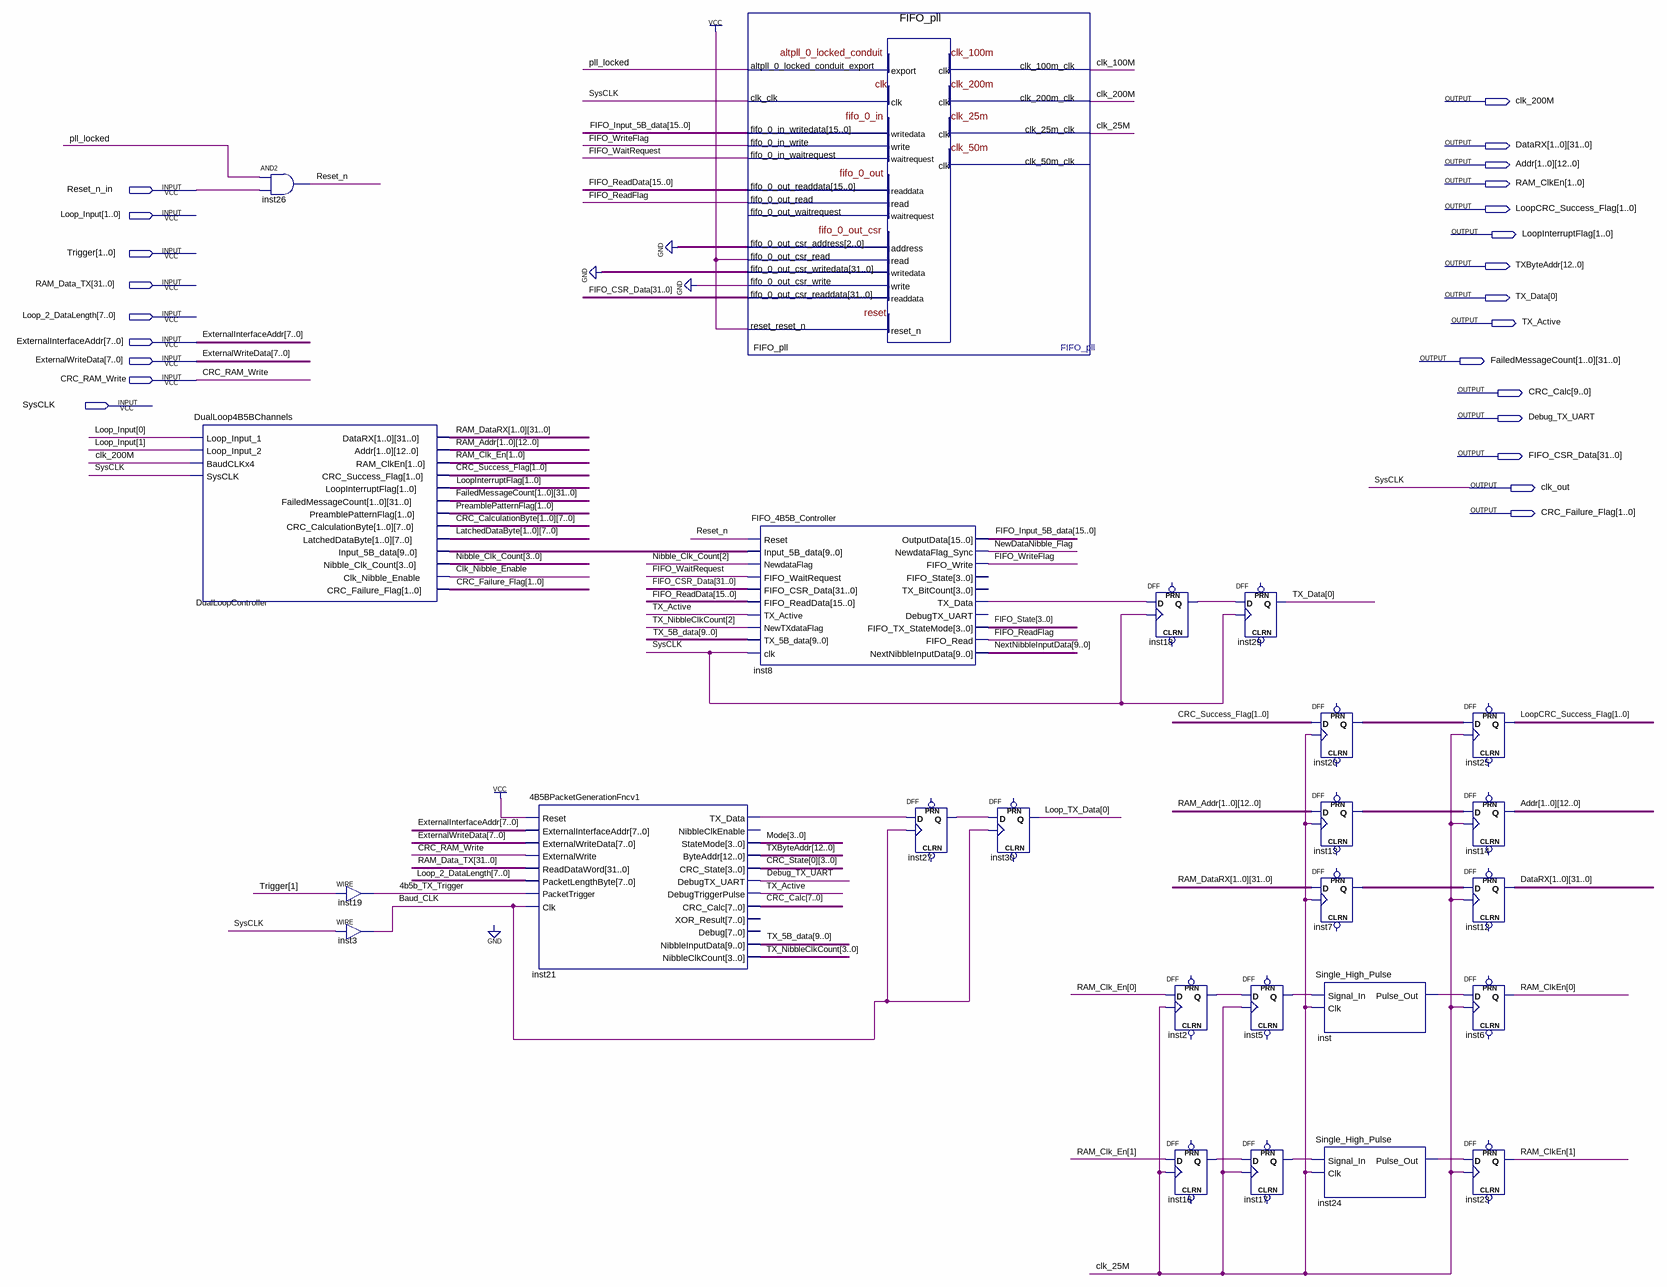
[diagram p0: schematic sheet]
// Quartus schematic LoopDataController.bdf as structural Verilog: 25 symbols, 24 pins
module LoopDataController (
  input  Reset_n_in,
  input  [1:0] Loop_Input,
  input  [1:0] Trigger,
  input  [31:0] RAM_Data_TX,
  input  [7:0] Loop_2_DataLength,
  input  [7:0] ExternalInterfaceAddr,
  input  [7:0] ExternalWriteData,
  input  CRC_RAM_Write,
  input  SysCLK,
  output clk_200M,
  output [31:0] DataRX_1,
  output [31:0] DataRX_0,
  output [12:0] Addr_1,
  output [12:0] Addr_0,
  output [1:0] RAM_ClkEn,
  output [1:0] LoopCRC_Success_Flag,
  output [1:0] LoopInterruptFlag,
  output [12:0] TXByteAddr,
  output [0:0] TX_Data,
  output TX_Active,
  output [31:0] FailedMessageCount_1,
  output [31:0] FailedMessageCount_0,
  output [9:0] CRC_Calc,
  output Debug_TX_UART,
  output [31:0] FIFO_CSR_Data,
  output clk_out,
  output [1:0] CRC_Failure_Flag
);

  wire \4b5b_TX_Trigger , Baud_CLK, clk_25M, clk_100M, Clk_Nibble_Enable, FIFO_ReadFlag, FIFO_WaitRequest,
       FIFO_WriteFlag, inst2_q, inst5_q, inst8_tx_data, inst16_q, inst17_q, inst18_q, inst21_tx_data,
       inst24_pulse_out, inst27_q, inst_pulse_out, NewDataNibble_Flag, pll_locked, Reset_n;
  wire [0:0] Loop_TX_Data;
  wire [1:0] CRC_Success_Flag, inst20_q, PreamblePatternFlag, RAM_Clk_En;
  wire [3:0] CRC_State_0, FIFO_State, Mode, Nibble_Clk_Count, TX_NibbleClkCount;
  wire [7:0] CRC_CalculationByte_0, CRC_CalculationByte_1, LatchedDataByte_0, LatchedDataByte_1;
  wire [9:0] DualLoopController_input_5b_data, NextNibbleInputData, TX_5B_data;
  wire [12:0] RAM_Addr_0, RAM_Addr_1;
  wire [15:0] FIFO_Input_5B_data, FIFO_ReadData;
  wire [25:0] inst13_q;
  wire [31:0] RAM_DataRX_0, RAM_DataRX_1;
  wire [63:0] inst7_q;

  DualLoop4B5BChannels DualLoopController (
    .Loop_Input_1(Loop_Input[0]), .Loop_Input_2(Loop_Input[1]), .BaudCLKx4(clk_200M), .SysCLK(SysCLK),
    .DataRX({RAM_DataRX_1, RAM_DataRX_0}), .Addr({RAM_Addr_1, RAM_Addr_0}), .RAM_ClkEn(RAM_Clk_En),
    .CRC_Success_Flag(CRC_Success_Flag), .LoopInterruptFlag(LoopInterruptFlag),
    .FailedMessageCount({FailedMessageCount_1, FailedMessageCount_0}),
    .PreamblePatternFlag(PreamblePatternFlag),
    .CRC_CalculationByte({CRC_CalculationByte_1, CRC_CalculationByte_0}),
    .LatchedDataByte({LatchedDataByte_1, LatchedDataByte_0}),
    .Input_5B_data(DualLoopController_input_5b_data), .Nibble_Clk_Count(Nibble_Clk_Count),
    .Clk_Nibble_Enable(Clk_Nibble_Enable), .CRC_Failure_Flag(CRC_Failure_Flag));
  and inst26 (Reset_n, pll_locked, Reset_n_in);
  assign \4b5b_TX_Trigger  = Trigger[1];  // WIRE inst19
  assign Baud_CLK = SysCLK;  // WIRE inst3
  \4B5BPacketGenerationFncv1  inst21 (
    .Reset(1'b1), .ExternalInterfaceAddr(ExternalInterfaceAddr), .ExternalWriteData(ExternalWriteData),
    .ExternalWrite(CRC_RAM_Write), .ReadDataWord(RAM_Data_TX), .PacketLengthByte(Loop_2_DataLength),
    .PacketTrigger(\4b5b_TX_Trigger ), .Clk(Baud_CLK), .TX_Data(inst21_tx_data), .StateMode(Mode),
    .ByteAddr(TXByteAddr), .CRC_State(CRC_State_0), .DebugTX_UART(Debug_TX_UART),
    .DebugTriggerPulse(TX_Active), .CRC_Calc(CRC_Calc[7:0]), .NibbleInputData(TX_5B_data),
    .NibbleClkCount(TX_NibbleClkCount));  // open: NibbleClkEnable, XOR_Result, Debug
  FIFO_pll FIFO_pll (
    .clk_clk(SysCLK), .fifo_0_in_writedata(FIFO_Input_5B_data), .fifo_0_in_write(FIFO_WriteFlag),
    .fifo_0_out_read(FIFO_ReadFlag), .fifo_0_out_csr_address(3'b000), .fifo_0_out_csr_read(1'b1),
    .fifo_0_out_csr_writedata({32{1'b0}}), .fifo_0_out_csr_write(1'b0), .reset_reset_n(1'b1),
    .altpll_0_locked_conduit_export(pll_locked), .clk_100m_clk(clk_100M), .clk_200m_clk(clk_200M),
    .clk_25m_clk(clk_25M), .fifo_0_in_waitrequest(FIFO_WaitRequest), .fifo_0_out_readdata(FIFO_ReadData),
    .fifo_0_out_csr_readdata(FIFO_CSR_Data));  // open: clk_50m_clk, fifo_0_out_waitrequest
  FIFO_4B5B_Controller inst8 (
    .Reset(Reset_n), .Input_5B_data(DualLoopController_input_5b_data), .NewdataFlag(Nibble_Clk_Count[2]),
    .FIFO_WaitRequest(FIFO_WaitRequest), .FIFO_CSR_Data(FIFO_CSR_Data), .FIFO_ReadData(FIFO_ReadData),
    .TX_Active(TX_Active), .NewTXdataFlag(TX_NibbleClkCount[2]), .TX_5B_data(TX_5B_data), .clk(SysCLK),
    .OutputData(FIFO_Input_5B_data), .NewdataFlag_Sync(NewDataNibble_Flag), .FIFO_Write(FIFO_WriteFlag),
    .TX_Data(inst8_tx_data), .FIFO_TX_StateMode(FIFO_State), .FIFO_Read(FIFO_ReadFlag),
    .NextNibbleInputData(NextNibbleInputData));  // open: FIFO_State, TX_BitCount, DebugTX_UART
  DFF inst27 (.CLK(Baud_CLK), .D(inst21_tx_data), .Q(inst27_q));  // open: CLRN, PRN
  DFF inst30 (.CLK(Baud_CLK), .D(inst27_q), .Q(Loop_TX_Data[0]));  // open: CLRN, PRN
  DFF inst18 (.CLK(SysCLK), .D(inst8_tx_data), .Q(inst18_q));  // open: CLRN, PRN
  DFF inst2 (.CLK(clk_25M), .D(RAM_Clk_En[0]), .Q(inst2_q));  // open: CLRN, PRN
  DFF inst16 (.CLK(clk_25M), .D(RAM_Clk_En[1]), .Q(inst16_q));  // open: CLRN, PRN
  DFF inst29 (.CLK(SysCLK), .D(inst18_q), .Q(TX_Data[0]));  // open: CLRN, PRN
  DFF inst5 (.CLK(clk_25M), .D(inst2_q), .Q(inst5_q));  // open: CLRN, PRN
  DFF inst17 (.CLK(clk_25M), .D(inst16_q), .Q(inst17_q));  // open: CLRN, PRN
  DFF inst20[1:0] (.CLK(clk_25M), .D(CRC_Success_Flag), .Q(inst20_q));  // open: CLRN, PRN
  DFF inst13[25:0] (.CLK(clk_25M), .D({RAM_Addr_1, RAM_Addr_0}), .Q(inst13_q));  // open: CLRN, PRN
  DFF inst7[63:0] (.CLK(clk_25M), .D({RAM_DataRX_1, RAM_DataRX_0}), .Q(inst7_q));  // open: CLRN, PRN
  Single_High_Pulse inst (.Signal_In(inst5_q), .Clk(clk_25M), .Pulse_Out(inst_pulse_out));
  Single_High_Pulse inst24 (.Signal_In(inst17_q), .Clk(clk_25M), .Pulse_Out(inst24_pulse_out));
  DFF inst25[1:0] (.CLK(clk_25M), .D(inst20_q), .Q(LoopCRC_Success_Flag));  // open: CLRN, PRN
  DFF inst14[25:0] (.CLK(clk_25M), .D(inst13_q), .Q({Addr_1, Addr_0}));  // open: CLRN, PRN
  DFF inst12[63:0] (.CLK(clk_25M), .D(inst7_q), .Q({DataRX_1, DataRX_0}));  // open: CLRN, PRN
  DFF inst6 (.CLK(clk_25M), .D(inst_pulse_out), .Q(RAM_ClkEn[0]));  // open: CLRN, PRN
  DFF inst23 (.CLK(clk_25M), .D(inst24_pulse_out), .Q(RAM_ClkEn[1]));  // open: CLRN, PRN

  assign clk_out = SysCLK;
endmodule
